# EAGLE design PCB-ENCODER2a (EAGLE 7.2.0)
SKAARHOJ 2012 Rotary Encoder Breakout Board
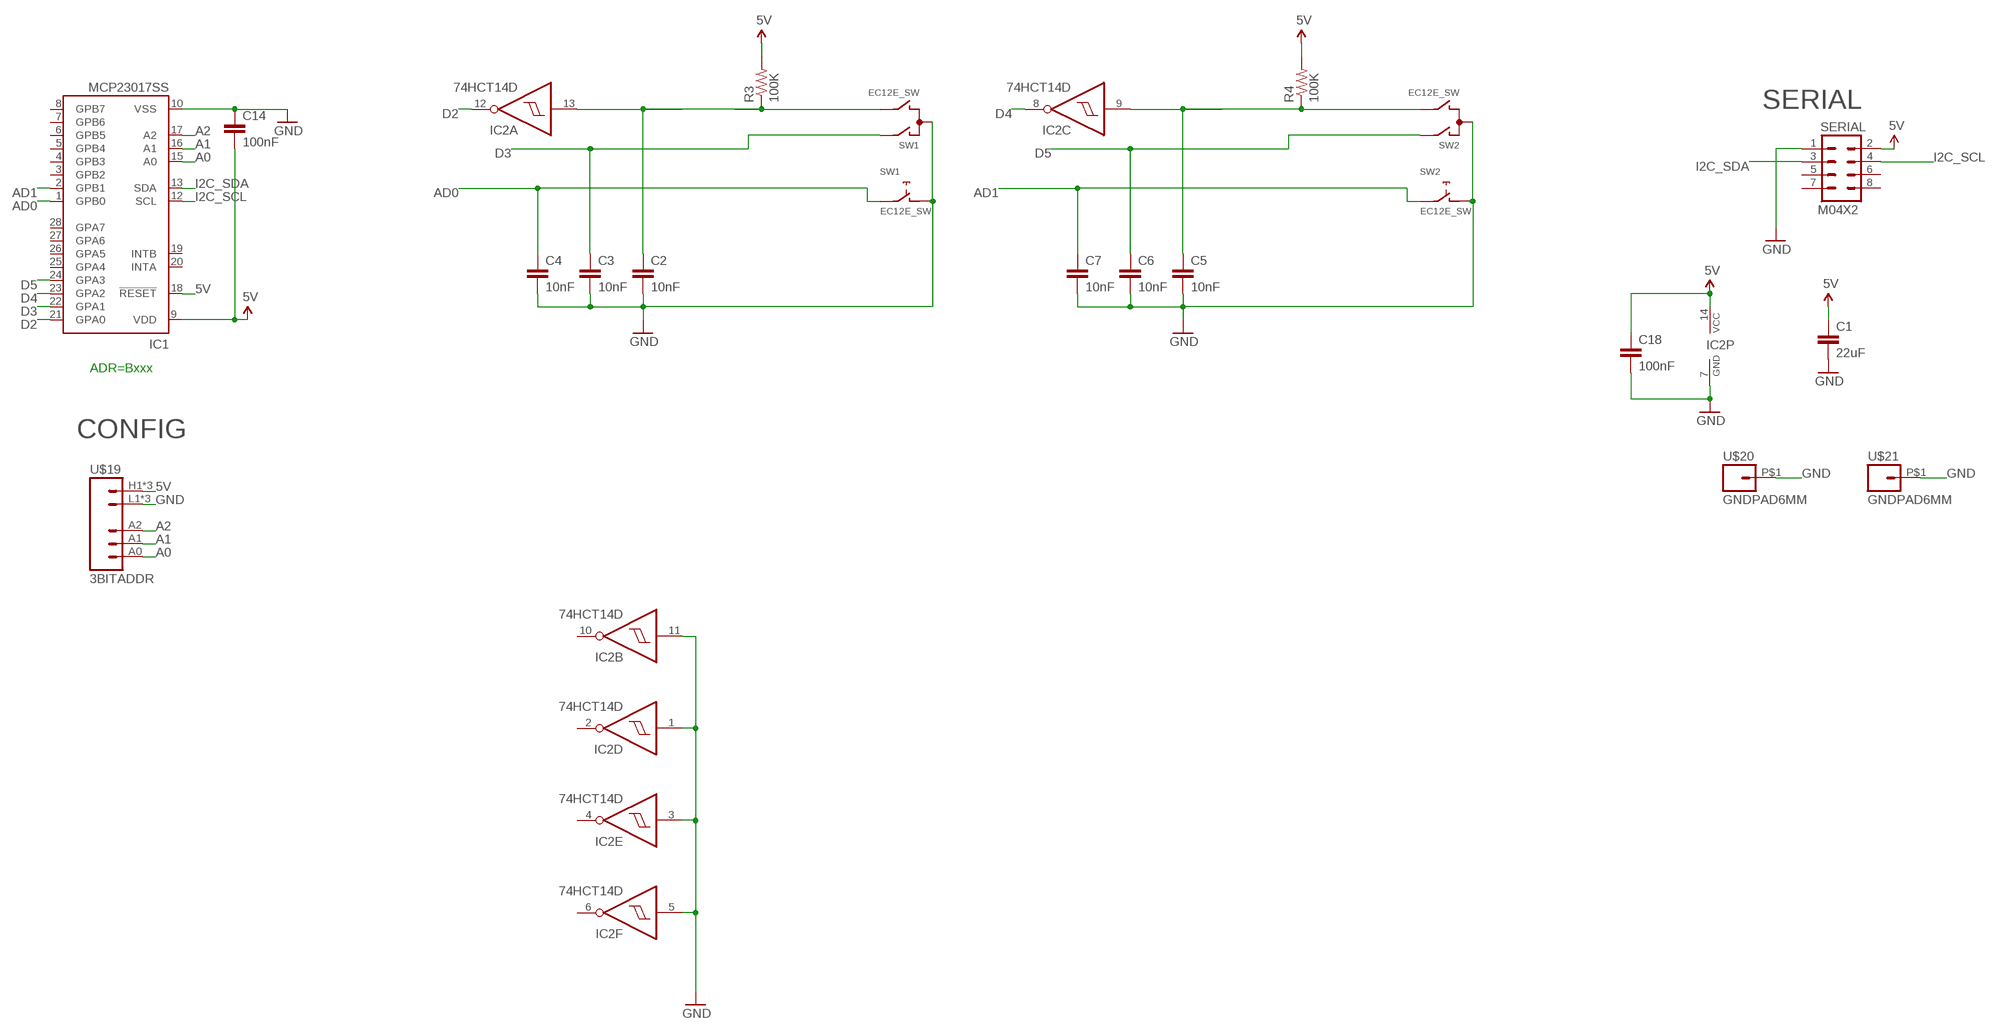
[diagram p0: schematic, sheet 1]

## Parts
C1  22uF  CAP0805  [0805]
C2  10nF  CAP0603-CAP  [0603-CAP]
C3  10nF  CAP0603-CAP  [0603-CAP]
C4  10nF  CAP0603-CAP  [0603-CAP]
C5  10nF  CAP0603-CAP  [0603-CAP]
C6  10nF  CAP0603-CAP  [0603-CAP]
C7  10nF  CAP0603-CAP  [0603-CAP]
C14  100nF  CAP0603-CAP  [0603-CAP]
C18  100nF  CAP0603-CAP  [0603-CAP]
IC1  MCP23017SS  [SSOP28]
IC2  74HCT14D  [SO14]
R3  100K  RESISTOR0603-RES  [0603-RES]
R4  100K  RESISTOR0603-RES  [0603-RES]
SERIAL  M04X2  [2X4]
SW1  EC12E_SW  [ALPS_EC12E_SW]
SW2  EC12E_SW  [ALPS_EC12E_SW]
U$19  3BITADDR  [3BITADDR]
U$20  GNDPAD6MM  [3.2MMPAD6MM]
U$21  GNDPAD6MM  [3.2MMPAD6MM]

## Nets
5V [Power]: C1.1 C14.2 C18.1 IC1.9(VDD) IC1.18(!RESET) IC2.14(P:VCC) R3.2 R4.2 SERIAL.2 U$19.H1(VCC) U$19.H2(VCC) U$19.H3(VCC)
A0: IC1.15(A0) U$19.A0
A1: IC1.16(A1) U$19.A1
A2: IC1.17(A2) U$19.A2
AD0: C4.1 IC1.1(GPB0) SW1.E
AD1: C7.1 IC1.2(GPB1) SW2.E
D2: IC1.21(GPA0) IC2.12(A:O)
D3: C3.1 IC1.22(GPA1) SW1.A
D4: IC1.23(GPA2) IC2.8(C:O)
D5: C6.1 IC1.24(GPA3) SW2.A
GND [Power]: C1.2 C2.2 C3.2 C4.2 C5.2 C6.2 C7.2 C14.1 C18.2 IC1.10(VSS) IC2.1(D:I) IC2.3(E:I) IC2.5(F:I) IC2.7(P:GND) IC2.11(B:I) SERIAL.1 SW1.C SW1.D SW2.C SW2.D U$19.L1(GND) U$19.L2(GND) U$19.L3(GND) U$20.P$1 U$21.P$1
I2C_SCL: IC1.12(SCL) SERIAL.4
I2C_SDA: IC1.13(SDA) SERIAL.3
N$1: C2.1 IC2.13(A:I) R3.1 SW1.B
N$6: C5.1 IC2.9(C:I) R4.1 SW2.B
Unconnected: IC1.3(GPB2) IC1.4(GPB3) IC1.5(GPB4) IC1.6(GPB5) IC1.7(GPB6) IC1.8(GPB7) IC1.19(INTB) IC1.20(INTA) IC1.25(GPA4) IC1.26(GPA5) IC1.27(GPA6) IC1.28(GPA7) IC2.2(D:O) IC2.4(E:O) IC2.6(F:O) IC2.10(B:O) SERIAL.5 SERIAL.6 SERIAL.7 SERIAL.8 SW1.GND1(G) SW1.GND2(G) SW2.GND1(G) SW2.GND2(G)

## Notes on the sheet
- SERIAL
- ADR=Bxxx
- CONFIG

## Library data of the parts
C1-C7 C14 C18 = SparkFun:CAP: Capacitor Standard 0603 ceramic capacitor, and 0.1" leaded capacitor.
IC1 = microchip:MCP23017: http://ww1.microchip.com/downloads/en/DeviceDoc/21952a.pdf Source: http://ww1.microchip.com/downloads/en/DeviceDoc/21952a.pdf; MF: MICROCHIP; MPN: MCP23017-E/SS; OC_FARNELL: 1467674; OC_NEWARK: 31K2960
IC2 = 74xx-eu:74*14: Hex schmitt trigger INVERTER
R3 R4 = SparkFun:RESISTOR: Resistor Basic schematic elements and footprints for 0603, 1206, and PTH resistors.
SERIAL = SparkFun:M04X2
SW1 SW2 = switch-alps:EC12E_SW: ALPS rotary Encoder EC12E series with switch; MPN: EC12E2424407; OC_FARNELL: 1520813; OC_NEWARK: 74M1068
U$19 = SKAARHOJ:3BITADDR
U$20 U$21 = SKAARHOJ:GNDPAD

## Net classes
0 default: width 0.203 mm, drill 0.406 mm, clearance 0.203 mm
1 Power: width 0.254 mm, drill 0.406 mm, clearance 0.254 mm

## Board
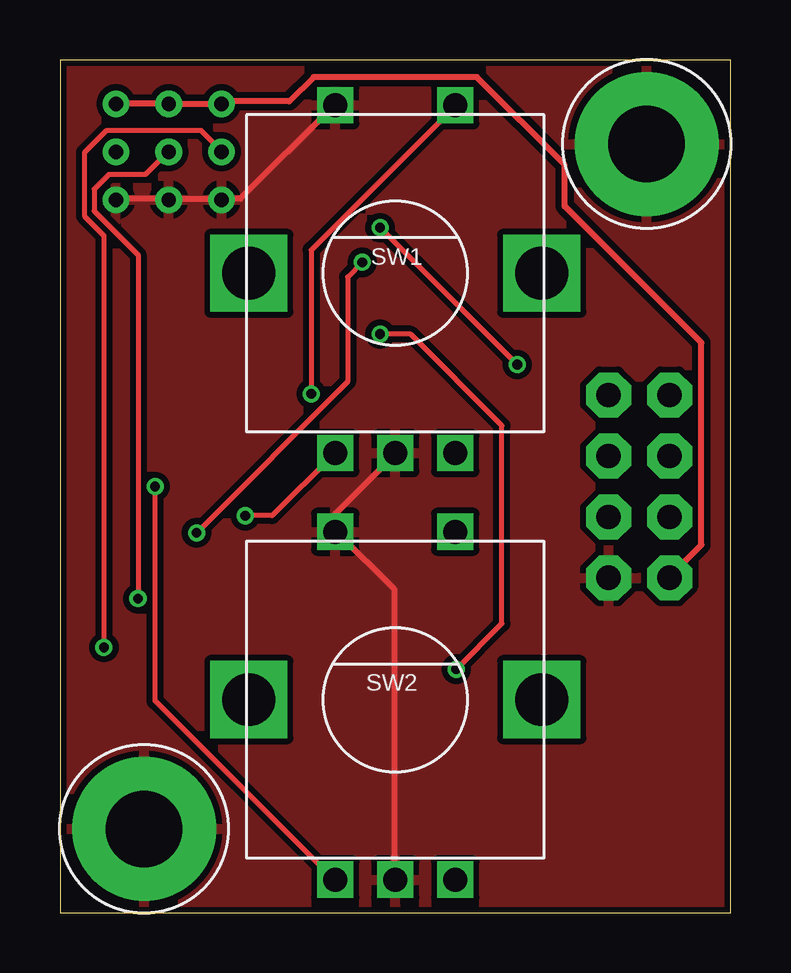
[diagram p1: board, top side]
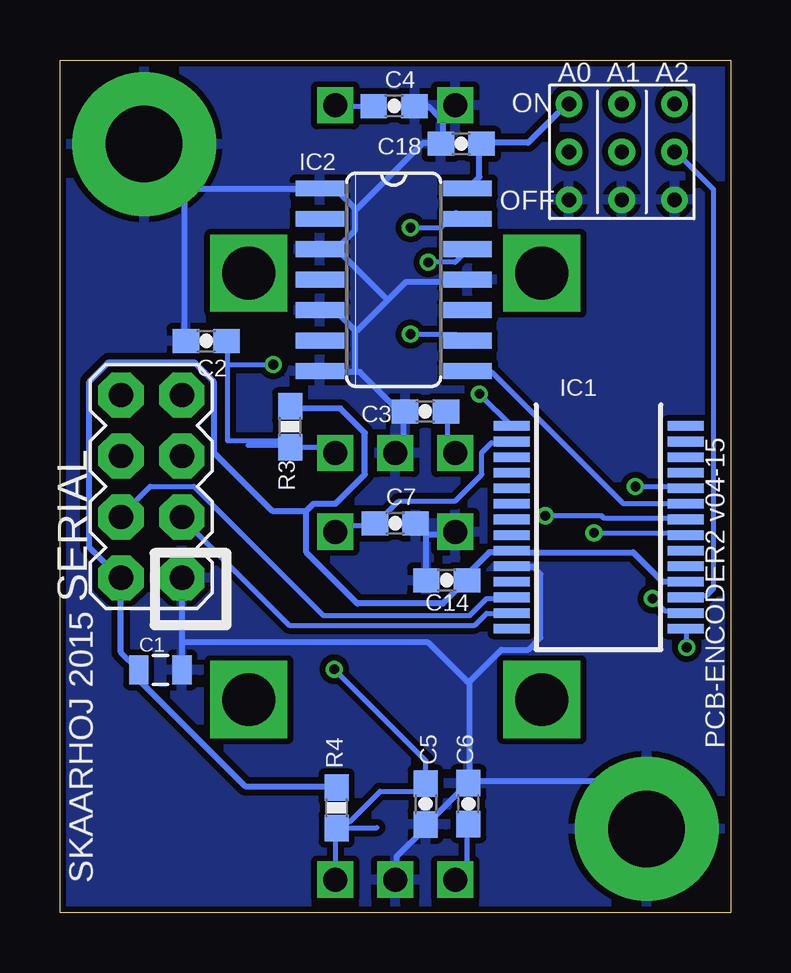
[diagram p2: board, bottom side, seen from below]

Size 27.94 x 35.56 mm. Coordinates in mm from the lower left corner, seen from the top.
Outline: 0,0 27.94,0 27.94,35.56 0,35.56 0,0
Copper layers (1*16): Top 0.035mm / dielectric 1.5mm / Bottom 0.035mm
Design rules "Fusion_eagle_rule_v1.1": minimum track width 6mil, minimum drill 12mil, track to track 6mil, track to pad 6mil, pad to pad 6mil, via to via 6mil, smd to smd 0mil, copper to edge 10mil, drill to drill 10mil, minimum pad ring 10mil, minimum via ring 6mil, stop-mask expansion 2mil, vias tented up to drill 100mil, thermal gap 10mil

### Footprints (pad centres in the part's own frame; a part is rotated, then mirrored left to right if it is on the bottom)
0805 = smd 0.8 x 1.2: 1 -0.9,0; 2 0.9,0
0603-CAP = smd 1.1 x 1: 1 -0.85,0; 2 0.85,0
SSOP28 = smd 0.4 x 1.5: 1 -4.225,-3.625; 2 -3.575,-3.625; 3 -2.925,-3.625; 4 -2.275,-3.625; 5 -1.625,-3.625; 6 -0.975,-3.625; 7 -0.325,-3.625; 8 0.325,-3.625; 9 0.975,-3.625; 10 1.625,-3.625; 11 2.275,-3.625; 12 2.925,-3.625; 13 3.575,-3.625; 14 4.225,-3.625; 15 4.225,3.625; 16 3.575,3.625; 17 2.925,3.625; 18 2.275,3.625; 19 1.625,3.625; 20 0.975,3.625; 21 0.325,3.625; 22 -0.325,3.625; 23 -0.975,3.625; 24 -1.625,3.625; 25 -2.275,3.625; 26 -2.925,3.625; 27 -3.575,3.625; 28 -4.225,3.625
SO14 = smd 0.66 x 2.032: 1 -3.81,-3.073; 2 -2.54,-3.073; 3 -1.27,-3.073; 4 0,-3.073; 5 1.27,-3.073; 6 2.54,-3.073; 7 3.81,-3.073; 8 3.81,3.073; 9 2.54,3.073; 10 1.27,3.073; 11 0,3.073; 12 -1.27,3.073; 13 -2.54,3.073; 14 -3.81,3.073
0603-RES = smd 1.1 x 1: 1 -0.85,0; 2 0.85,0
2X4 = drill 1.016 pad 1.88 octagon: 1 -3.81,-1.27; 2 -3.81,1.27; 3 -1.27,-1.27; 4 -1.27,1.27; 5 1.27,-1.27; 6 1.27,1.27; 7 3.81,-1.27; 8 3.81,1.27
ALPS_EC12E_SW = drill 1 square: A -2.5,-7.5; B 2.5,-7.5; C 0,-7.5; D -2.5,7; E 2.5,7 | drill 2.2 square: GND1 -6.1,0; GND2 6.1,0
3BITADDR = drill 0.6: A0 -2.2,0; A1 0,0; A2 2.2,0; H1 -2.2,2; H2 0,2; H3 2.2,2; L1 -2.2,-2; L2 0,-2; L3 2.2,-2
3.2MMPAD6MM = drill 3.2 pad 6: P$1 0,0

### Placement (x,y rotation side)
C1  23.76,10.13 0 bottom
C2  21.85,23.84 180 bottom
C3  12.71,20.91 180 bottom
C4  14.02,33.64 0 bottom
C5  12.7,4.54 270 bottom
C6  10.92,4.56 90 bottom
C7  13.97,16.24 0 bottom
C14  11.83,13.86 0 bottom
C18  11.22,32.07 180 bottom
IC1  5.5,16.08 270 bottom
IC2  14.04,26.4 270 bottom
R3  18.35,20.27 90 bottom
R4  16.41,4.38 90 bottom
SERIAL  24.13,17.78 90 bottom
SW1  13.97,26.67 0 top
SW2  13.97,8.89 0 top
U$19  4.53,31.73 0 bottom
U$20  3.5,3.5 0 top
U$21  24.44,32.06 0 top

### Tracks (layer width: path | path; a pad name or v marks a point on that pad's centre or on a via)
5V
  Top 0.254: U$19.H3 4.47,33.73 U$19.H2 4.57,33.73 6.71,33.73 U$19.H1 6.81,33.83 9.55,33.83 10.57,34.85 17.37,34.85 21.03,31.19 21.03,29.46 26.72,23.77 26.72,15.34 25.4,14.02 SERIAL.2
  Bottom 0.254: 17.68,16.76 17.37,17.07 16.46,17.07 15.24,18.29 15.24,20.02 16.26,21.03 18.29,21.03 R3.2 | 17.68,16.76 17.68,15.04 15.54,12.9 11.99,12.9 11.07,13.82 C14.2 10.97,13.92 10.97,14.12 10.06,15.04 9.14,15.04 IC1.9 9.04,15.04 4.06,15.04 2.85,13.82 1.93,13.82 IC1.18 | IC2.14 10.87,30.28 10.46,30.68 10.46,32 C18.1 10.26,32.11 8.43,32.11 6.81,33.73 U$19.H1 | R4.2 16.46,5.28 20.22,5.28 24.59,9.65 24.59,10.06 C1.1 24.69,10.16 25.4,10.87 SERIAL.2 25.5,14.02 26.72,15.24 26.72,22.15 25.91,22.96 22.35,22.96 21.54,22.15 21.54,19.2 19.1,16.76 17.68,16.76
A0  (via drill 0.41)
  Top 0.203: v1.83,11.07 1.83,28.25 1.02,29.06 1.02,31.7 1.93,32.61 5.89,32.61 6.71,31.8 U$19.A0
  Bottom 0.203: v1.83,11.07 1.83,11.79 IC1.15
A1  (via drill 0.41)
  Top 0.203: v3.25,13.11 3.25,27.43 1.42,29.26 1.42,30.18 2.03,30.79 3.56,30.79 4.47,31.7 U$19.A1
  Bottom 0.203: v3.25,13.11 2.74,12.6 1.93,12.6 IC1.16
A2
  Bottom 0.203: IC1.17 1.83,13.21 1.02,13.21 0.71,13.51 0.71,30.18 2.23,31.7 U$19.A2
AD0  (via drill 0.41)
  Top 0.203: v10.46,21.64 10.46,27.64 16.46,33.63 SW1.E
  Bottom 0.203: C4.1 14.94,33.63 16.46,33.63 SW1.E | v10.46,21.64 9.14,20.32 IC1.1
AD1
  Bottom 0.203: SW2.E 16.46,15.95 16.26,16.15 14.83,16.15 C7.1 14.73,16.26 13.82,17.17 11.48,17.17 10.36,18.29 10.36,19.2 9.96,19.61 9.14,19.61 IC1.2
D2  (via drill 0.41)
  Top 0.203: v5.69,15.85 11.99,22.15 11.99,26.52 v12.6,27.13
  Bottom 0.203: v5.69,15.85 1.93,15.85 IC1.21 | v12.6,27.13 11.48,27.13 10.97,27.64 IC2.12
D3  (via drill 0.41)
  Top 0.203: v7.72,16.56 8.84,16.56 11.38,19.1 SW1.A
  Bottom 0.203: C3.1 11.79,20.83 11.79,19.51 11.48,19.2 SW1.A | v7.72,16.56 5.38,16.56 5.28,16.46 1.93,16.46 IC1.22
D4
  Bottom 0.203: IC1.23 1.93,17.07 4.47,17.07 9.96,22.55 10.87,22.55 IC2.8
D5  (via drill 0.41)
  Top 0.203: v3.96,17.78 3.96,8.84 11.38,1.42 SW2.A
  Bottom 0.203: C6.1 10.97,3.66 10.97,1.83 11.38,1.42 SW2.A | v3.96,17.78 1.93,17.78 IC1.24
GND
  Top 0.254: U$19.L3 2.34,29.77 4.47,29.77 U$19.L2 4.57,29.77 6.71,29.77 U$19.L1 6.81,29.77 7.52,29.77 11.38,33.63 SW1.D | SW1.C 13.92,19.1 11.48,16.66 11.48,15.95 SW2.D 11.58,15.85 13.92,13.51 13.92,1.42 SW2.C
  Bottom 0.254: SERIAL.1 22.86,11.28 | 22.86,11.28 C1.2 | C6.2 10.97,5.38 12.7,3.66 C5.2 12.7,3.56 13.92,2.34 13.92,1.42 SW2.C | 10.87,9.65 9.55,10.97 8.43,10.97 7.92,11.48 7.92,14.12 8.23,14.43 9.04,14.43 IC1.10 | 10.87,9.65 10.87,5.49 C6.2 | 22.86,11.28 12.6,11.28 10.97,9.65 10.87,9.65 | U$20.P$1 5.49,5.49 10.77,5.49 C6.2 | C2.2 22.76,23.88 22.76,30.38 U$21.P$1 22.66,30.18 17.17,30.18 IC2.1 17.07,30.18 16.46,30.18 15.65,29.36 | C14.1 12.7,13.92 12.7,15.75 13.11,16.15 C7.2 12.6,15.75 11.58,15.75 11.48,15.85 SW2.D | C4.2 13.11,33.63 12.6,33.63 12.09,33.12 SW1.D 11.48,33.63 11.99,33.12 11.99,32.11 C18.2 12.19,32.11 12.8,32.11 15.54,29.36 15.65,29.36 | 17.17,22.66 IC2.7 17.07,22.55 15.65,22.55 | SW1.C 13.92,19.2 13.61,19.51 13.61,20.83 C3.2 13.72,20.83 15.44,22.55 15.65,22.55 | 15.65,24.28 16.46,25.09 17.07,25.09 IC2.5 | 15.65,22.55 15.65,24.28 | 14.28,25.55 15.54,24.28 15.65,24.28 | 14.28,25.55 13.51,26.31 10.97,26.31 IC2.11 | 14.28,25.55 16.36,27.64 17.07,27.64 IC2.3 16.36,27.74 15.65,28.45 15.65,29.36
  pour Top: 0,0 28,0 28,36 0,36
  pour Bottom: 0,0 28,0 28,36 0,36
I2C_SCL
  Bottom 0.203: IC1.12 9.14,13.11 10.16,13.11 10.87,12.39 16.97,12.39 22.35,17.78 24.18,17.78 25.4,16.56 SERIAL.4
I2C_SDA
  Bottom 0.203: IC1.13 9.14,12.5 10.16,12.5 10.67,11.99 18.39,11.99 22.86,16.46 SERIAL.3
N$1  (via drill 0.41)
  Top 0.203: v19.05,22.86 v13.34,28.57
  Bottom 0.203: 20.12,19.51 18.39,19.51 R3.1 | R3.1 18.29,19.41 16.76,19.41 16.56,19.2 SW1.B | 20.95,22.86 20.95,19.68 18.41,19.68 R3.1 | 20.95,22.86 20.95,23.5 C2.1 | v13.34,28.57 12.06,28.57 11.43,29.21 IC2.13 | 20.95,22.86 v19.05,22.86
N$6  (via drill 0.41)
  Top 0.203: v13.34,24.13 14.61,24.13 18.41,20.32 18.41,12.06 v16.51,10.16
  Bottom 0.203: 14.73,3.56 16.36,3.56 R4.1 | R4.1 16.46,3.45 16.46,1.42 SW2.B | R4.1 16.51,3.81 15.88,3.81 14.61,5.08 12.7,5.08 C5.1 12.7,5.71 12.7,6.35 v16.51,10.16 | v13.34,24.13 11.43,24.13 IC2.9

### Text on the board
_bsilk: SKAARHOJ 2015 | PCB-ENCODER2 v04-15